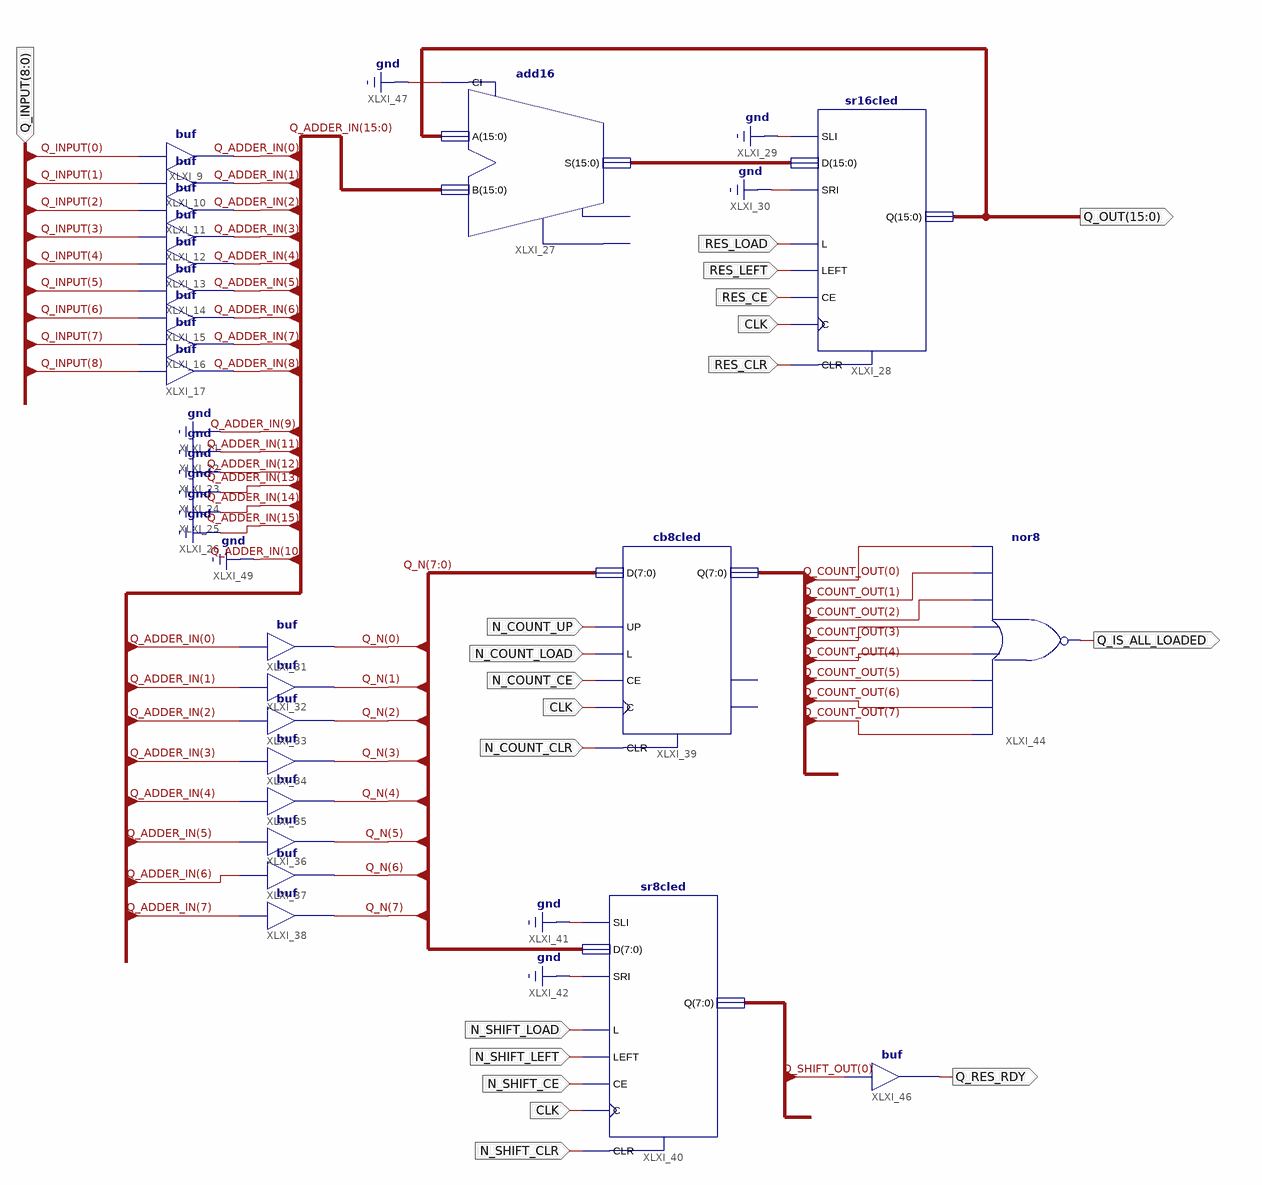
[diagram p0: schematic sheet 1]
// Xilinx ISE schematic lab5_datapath.sch (spartan3a) as structural Verilog: 23 symbols, 17 ports
module lab5_datapath (
  input  [8:0] Q_INPUT,
  input  RES_LOAD,
  input  RES_LEFT,
  input  RES_CE,
  input  CLK,
  input  N_COUNT_UP,
  input  N_COUNT_LOAD,
  input  N_COUNT_CE,
  input  N_SHIFT_LOAD,
  input  N_SHIFT_LEFT,
  input  N_SHIFT_CE,
  input  RES_CLR,
  input  N_COUNT_CLR,
  input  N_SHIFT_CLR,
  output [15:0] Q_OUT,
  output Q_IS_ALL_LOADED,
  output Q_RES_RDY
);

  wire [7:0] Q_COUNT_OUT, Q_N, Q_SHIFT_OUT;
  wire [8:0] Q_ADDER_IN;
  wire [15:0] XLXN_113;

  buf XLXI_9 (Q_ADDER_IN[0], Q_INPUT[0]);
  buf XLXI_10 (Q_ADDER_IN[1], Q_INPUT[1]);
  buf XLXI_11 (Q_ADDER_IN[2], Q_INPUT[2]);
  buf XLXI_12 (Q_ADDER_IN[3], Q_INPUT[3]);
  buf XLXI_13 (Q_ADDER_IN[4], Q_INPUT[4]);
  buf XLXI_14 (Q_ADDER_IN[5], Q_INPUT[5]);
  buf XLXI_15 (Q_ADDER_IN[6], Q_INPUT[6]);
  buf XLXI_16 (Q_ADDER_IN[7], Q_INPUT[7]);
  buf XLXI_17 (Q_ADDER_IN[8], Q_INPUT[8]);
  add16 XLXI_27 (.A(Q_OUT), .B({{7{1'b0}}, Q_ADDER_IN}), .CI(1'b0), .S(XLXN_113));  // open: CO, OFL
  sr16cled XLXI_28 (
    .C(CLK), .CE(RES_CE), .CLR(RES_CLR), .D(XLXN_113), .L(RES_LOAD), .LEFT(RES_LEFT), .SLI(1'b0), .SRI(1'b0),
    .Q(Q_OUT));
  cb8cled XLXI_39 (
    .C(CLK), .CE(N_COUNT_CE), .CLR(N_COUNT_CLR), .D(Q_N), .L(N_COUNT_LOAD), .UP(N_COUNT_UP), .Q(Q_COUNT_OUT));  // open: CEO, TC
  sr8cled XLXI_40 (
    .C(CLK), .CE(N_SHIFT_CE), .CLR(N_SHIFT_CLR), .D(Q_N), .L(N_SHIFT_LOAD), .LEFT(N_SHIFT_LEFT), .SLI(1'b0),
    .SRI(1'b0), .Q(Q_SHIFT_OUT));
  nor XLXI_44 (Q_IS_ALL_LOADED, Q_COUNT_OUT[7], Q_COUNT_OUT[6], Q_COUNT_OUT[5], Q_COUNT_OUT[4], Q_COUNT_OUT[3], Q_COUNT_OUT[2], Q_COUNT_OUT[1], Q_COUNT_OUT[0]);
  buf XLXI_46 (Q_RES_RDY, Q_SHIFT_OUT[0]);
  buf XLXI_38 (Q_N[7], Q_ADDER_IN[7]);
  buf XLXI_37 (Q_N[6], Q_ADDER_IN[6]);
  buf XLXI_36 (Q_N[5], Q_ADDER_IN[5]);
  buf XLXI_35 (Q_N[4], Q_ADDER_IN[4]);
  buf XLXI_34 (Q_N[3], Q_ADDER_IN[3]);
  buf XLXI_33 (Q_N[2], Q_ADDER_IN[2]);
  buf XLXI_32 (Q_N[1], Q_ADDER_IN[1]);
  buf XLXI_31 (Q_N[0], Q_ADDER_IN[0]);
endmodule
